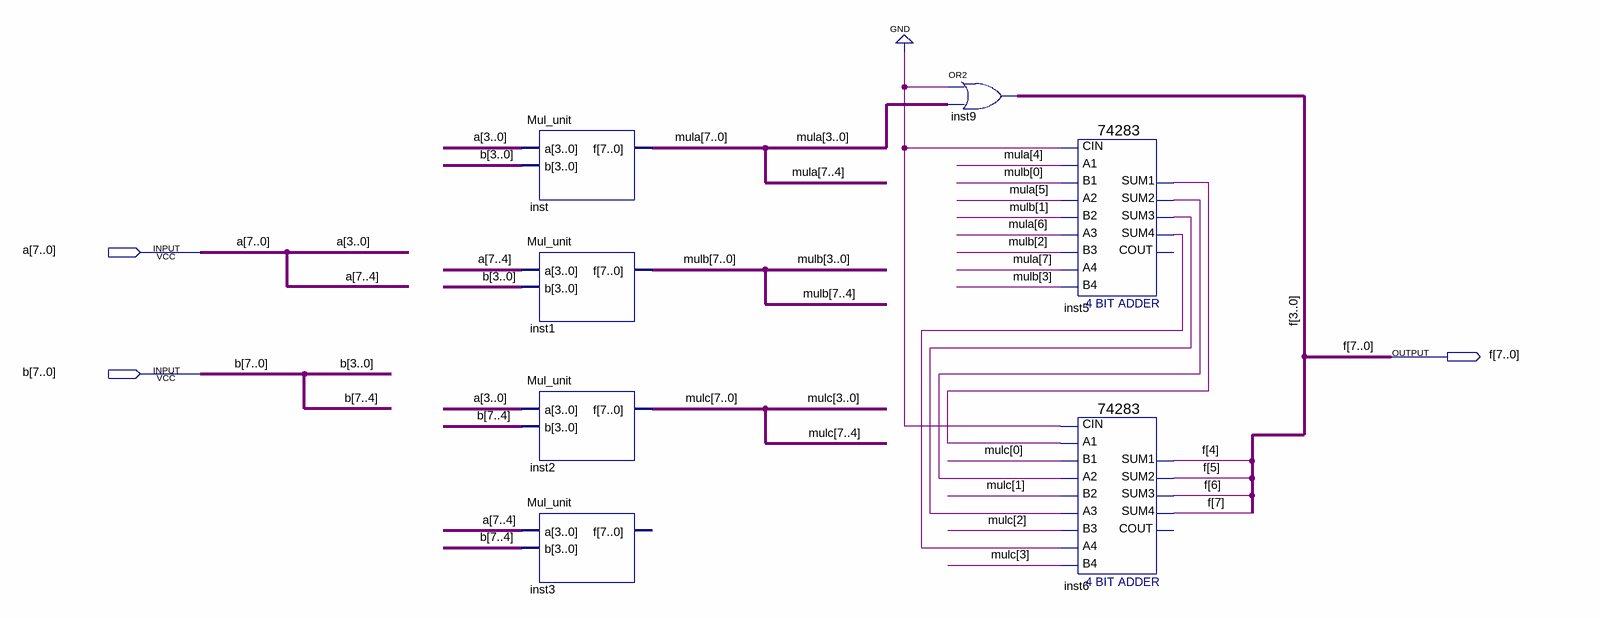
[diagram p0: schematic sheet]
// Quartus schematic Mul.bdf as structural Verilog: 7 symbols, 3 pins
module Mul (
  input  [7:0] a,
  input  [7:0] b,
  output [7:0] f
);

  wire inst5_sum1, inst5_sum2, inst5_sum3, inst5_sum4;
  wire [7:0] mula, mulb, mulc;

  Mul_unit inst (.a(a[3:0]), .b(b[3:0]), .f(mula));
  Mul_unit inst1 (.a(a[7:4]), .b(b[3:0]), .f(mulb));
  Mul_unit inst2 (.a(a[3:0]), .b(b[7:4]), .f(mulc));
  Mul_unit inst3 (.a(a[7:4]), .b(b[7:4]));  // open: f
  assign f[3:0] = 4'b0000 | mula[3:0];  // OR2 inst9, 4 bits wide
  \74283  inst5 (
    .CIN(1'b0), .A1(mula[4]), .A2(mula[5]), .B2(mulb[1]), .A3(mula[6]), .A4(mula[7]), .B4(mulb[3]),
    .B1(mulb[0]), .B3(mulb[2]), .SUM4(inst5_sum4), .SUM1(inst5_sum1), .SUM2(inst5_sum2), .SUM3(inst5_sum3));  // open: COUT
  \74283  inst6 (
    .CIN(1'b0), .A1(inst5_sum1), .A2(inst5_sum2), .B2(mulc[1]), .A3(inst5_sum3), .A4(inst5_sum4),
    .B4(mulc[3]), .B1(mulc[0]), .B3(mulc[2]), .SUM4(f[7]), .SUM1(f[4]), .SUM2(f[5]), .SUM3(f[6]));  // open: COUT
endmodule
